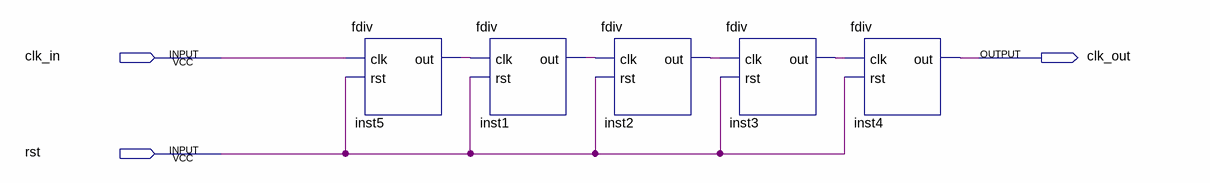
[diagram p0: schematic sheet]
// Quartus schematic fdiv5.bdf as structural Verilog: 5 symbols, 3 pins
module fdiv5 (
  input  clk_in,
  input  rst,
  output clk_out
);

  wire inst1_out, inst2_out, inst3_out, inst5_out;

  fdiv inst5 (.clk(clk_in), .rst(rst), .out(inst5_out));
  fdiv inst1 (.clk(inst5_out), .rst(rst), .out(inst1_out));
  fdiv inst2 (.clk(inst1_out), .rst(rst), .out(inst2_out));
  fdiv inst3 (.clk(inst2_out), .rst(rst), .out(inst3_out));
  fdiv inst4 (.clk(inst3_out), .rst(rst), .out(clk_out));
endmodule
